# Altium schematic sheet UWB_mB_carrier.SchDoc: Top Level Design
size B; CompanyName: Rigado, LLC; Organization: Rigado; SheetNumber: 1; Website: www.rigado.com; SheetSize: B
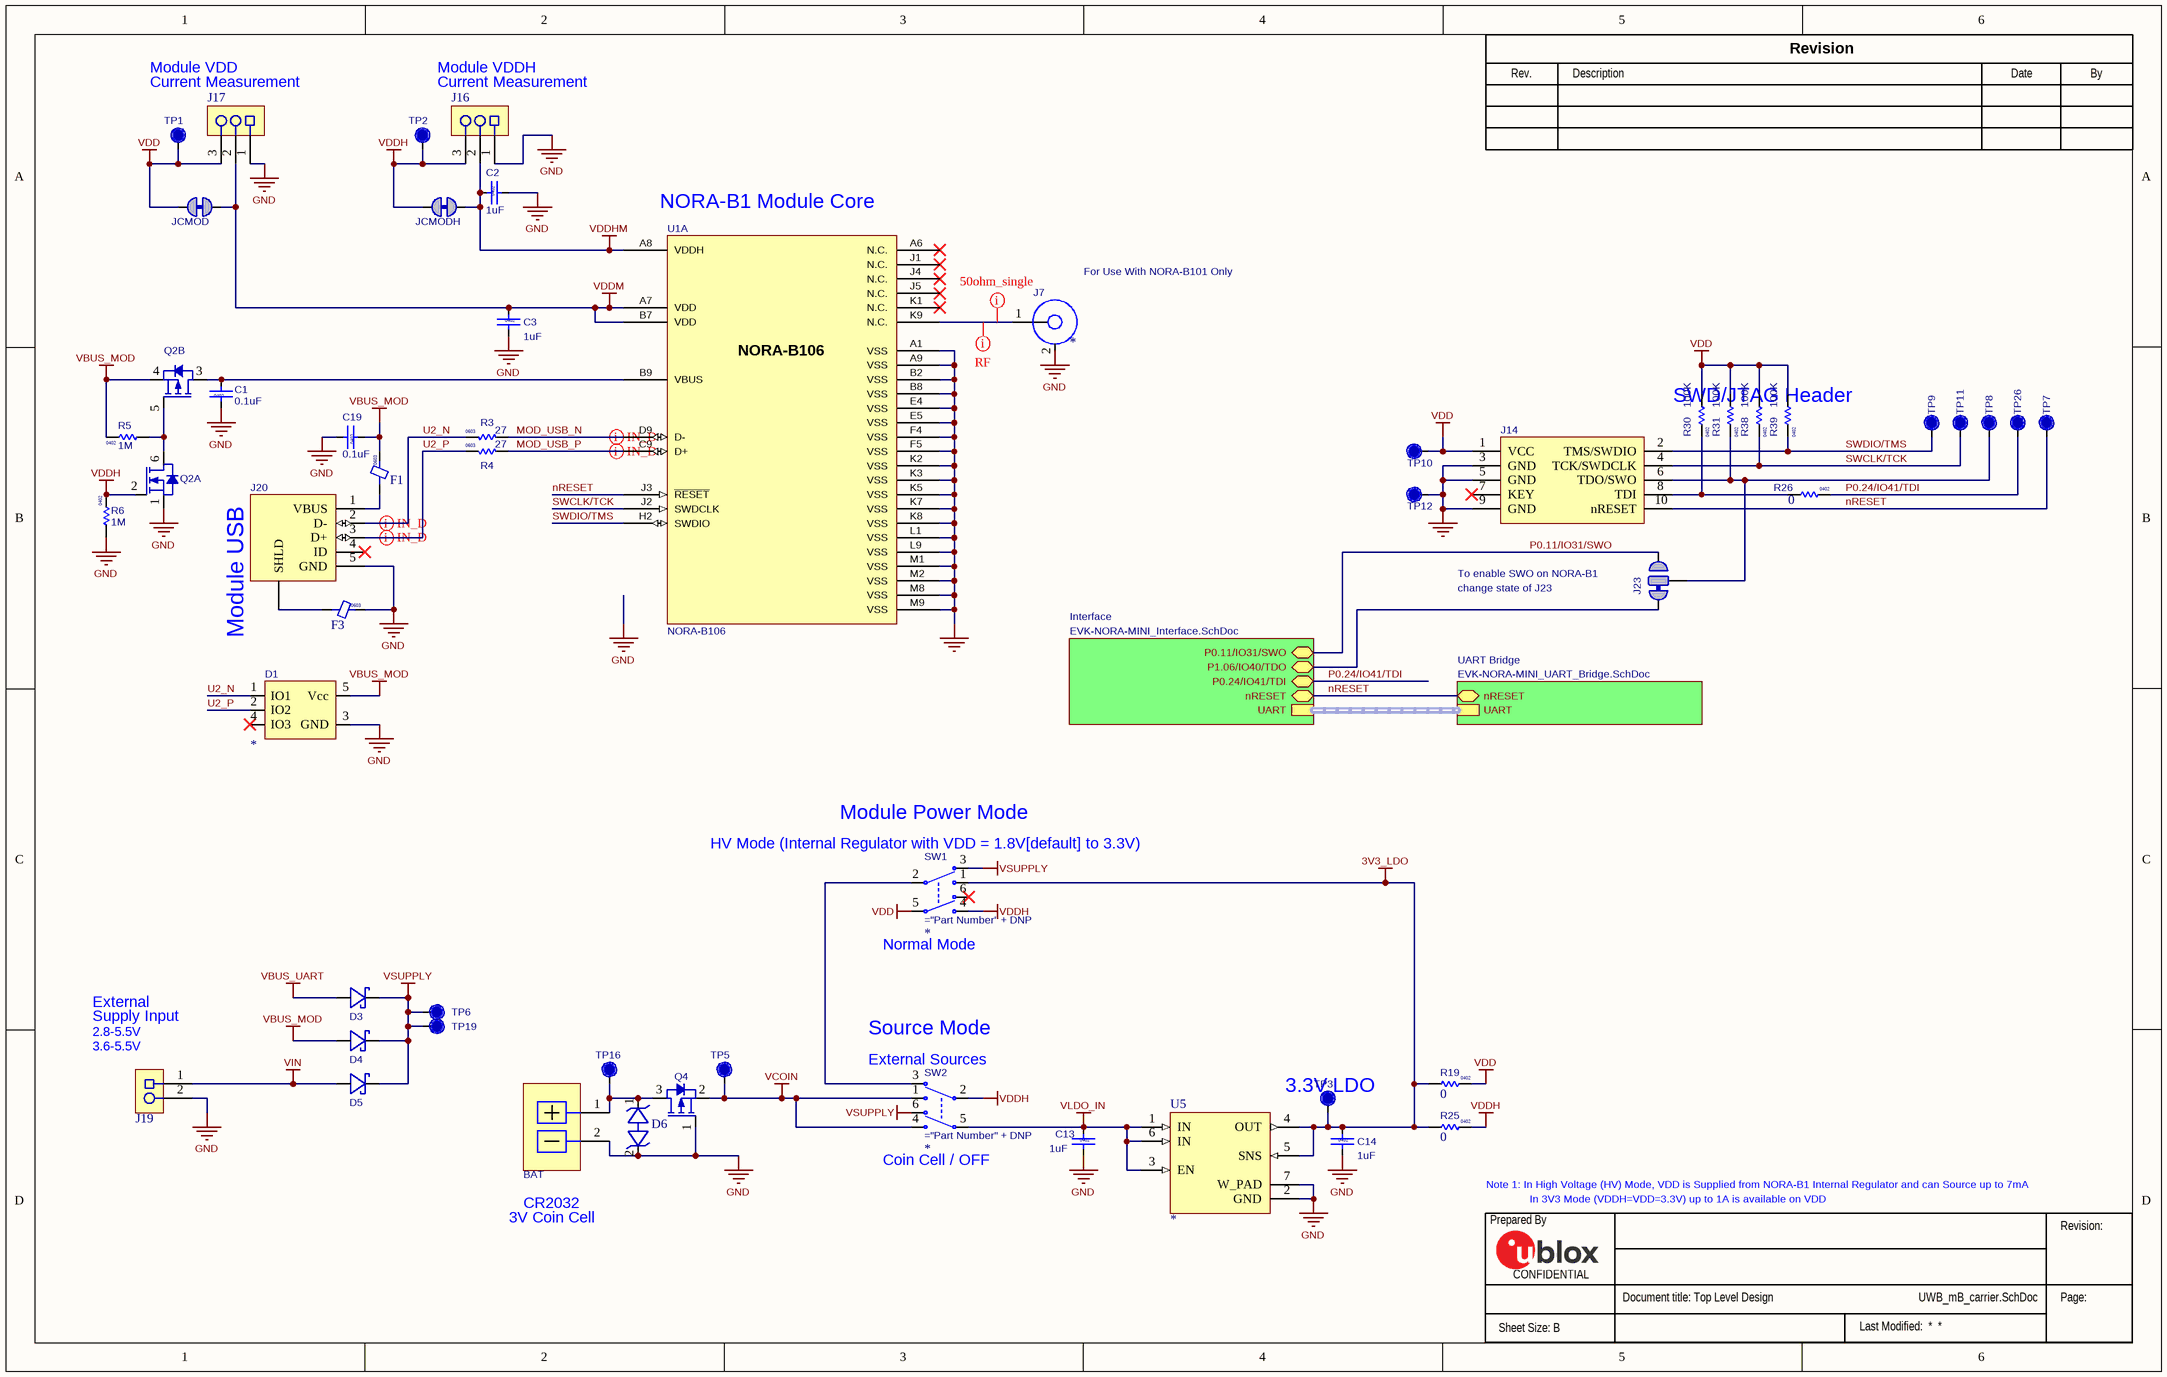
[diagram p0: UWB_mB_carrier.SchDoc]

## Parts
(Parts that share a designator on the sheet are numbered #1, #2 ... from top to bottom, then left to right.)
?#1  (no value)  (graphical)
?#2  (no value)  (graphical)
BAT  (no value)  [3034]
C1  value 0.1uF  Size: 0402  [Cap 0402 HD]
C2  value 1uF  Size: 0402  [Cap 0402 HD]
C3  value 1uF  Size: 0402  [Cap 0402 HD]
C13  value 1uF  Size: 0402  [Cap 0402 HD]
C14  value 1uF  Size: 0402  [Cap 0402 HD]
C19  value 0.1uF  Size: 0402  [Cap 0402 HD]
D1  (no value)  [SOT-553]
D3  (no value)  [Diode 0603 HD]
D4  (no value)  [Diode 0603 HD]
D5  (no value)  [Diode 0603 HD]
D6  (no value)  [SOD-323]
F1  Size: 0603  [IND 0603 HD]
F3  Size: 0603  [IND 0603 HD]
J7  (no value)  [U.FL_3Pin]
J14  (no value)  [HDR.050P-10Pin-2x5-SMT_Key]
J16  (no value)  [PREC003SAAN-RC]
J17  (no value)  [PREC003SAAN-RC]
J19  (no value)  [PREC002SAAN-RC]
J20  (no value)  [USB_Micro_RA_W-2TABS]
J23  Solderbridge-OptionDNP  [Solderbridge-Option]  (value not drawn)  (net tie, no BOM)
JCMOD  Solderbridge-ShortDNP  [Solderbridge-Short]  (value not drawn)  (net tie, no BOM)
JCMODH  Solderbridge-ShortDNP  [Solderbridge-Short]  (value not drawn)  (net tie, no BOM)
Q2  (no value)  [SOT-563]  (parts A,B of 2)
Q4  (no value)  [SOT-723]
R3  value 27  Size: 0603  [RES 0603 HD]
R4  value 27  Size: 0603  [RES 0603 HD]
R5  value 1M  Size: 0402  [RES 0402 HD]
R6  value 1M  Size: 0402  [RES 0402 HD]
R19  value 0  Size: 0402  [RES 0402]
R25  value 0  Size: 0402  [RES 0402]
R26  value 0  Size: 0402  [RES 0402]
R30  value 100K  Size: 0402  [RES 0402 HD]
R31  value 100K  Size: 0402  [RES 0402 HD]
R38  value 100K  Size: 0402  [RES 0402 HD]
R39  value 100K  Size: 0402  [RES 0402 HD]
SW1  (no value)  [SW_Slide_DPDT_JS202011SCQN]
SW2  (no value)  [SW_Slide_DPDT_JS202011SCQN]
TP1  TP  [TP12R]  (value not drawn)  (no BOM)
TP2  TP  [TP12R]  (value not drawn)  (no BOM)
TP3  TP  [TP12R]  (value not drawn)  (no BOM)
TP5  TP  [TP12R]  (value not drawn)  (no BOM)
TP6  TP  [TP12R]  (value not drawn)  (no BOM)
TP7  TP  [TP12R]  (value not drawn)  (no BOM)
TP8  TP  [TP12R]  (value not drawn)  (no BOM)
TP9  TP  [TP12R]  (value not drawn)  (no BOM)
TP10  TP  [TP12R]  (value not drawn)  (no BOM)
TP11  TP  [TP12R]  (value not drawn)  (no BOM)
TP12  TP  [TP12R]  (value not drawn)  (no BOM)
TP16  TP  [TP12R]  (value not drawn)  (no BOM)
TP19  TP  [TP12R]  (value not drawn)  (no BOM)
TP26  TP  [TP12R]  (value not drawn)  (no BOM)
U1  NORA-B106  [NORA_LGA82R_1430X1040X180_ANT]  (part A of 3)
U5  (no value)  [DFN0.95P-6Pin_W-Pad]

## Sub-sheets
Interface = EVK-NORA-MINI_Interface.SchDoc: UART (harness UART), nRESET (bidir), P0.11/IO31/SWO (bidir), P1.06/IO40/TDO (bidir), P0.24/IO41/TDI (bidir)
UART Bridge = EVK-NORA-MINI_UART_Bridge.SchDoc: UART (harness UART), nRESET (bidir)

## Nets
3V3_LDO: C14.1 R19.1 R25.1 SW1.1(N.O-1) TP3.1 U5.4(OUT) U5.5(SNS)
GND: BAT.2 C1.1 C2.2 C3.2 C13.2 C14.2 C19.2 D1.3(GND) D6.2 F3.2 J7.2 J14.3(GND) J14.5(GND) J14.9(GND) J16.1 J17.1 J19.2 J20.5(GND) Q2.1(S1) Q4.1(G) R6.1 TP12.1 U1.A1(VSS) U1.A9(VSS) U1.B2(VSS) U1.B8(VSS) U1.E4(VSS) U1.E5(VSS) U1.F4(VSS) U1.F5(VSS) U1.K2(VSS) U1.K3(VSS) U1.K5(VSS) U1.K7(VSS) U1.K8(VSS) U1.L1(VSS) U1.L9(VSS) U1.M1(VSS) U1.M2(VSS) U1.M8(VSS) U1.M9(VSS) U5.2(GND) U5.7(W_PAD)
VBUS_MOD: C19.1 D1.5(Vcc) D4.A(Anode) F1.2 Q2.4(S2) R5.2
VBUS_UART: D3.A(Anode)
VCOIN: Q4.2(S) SW2.1(N.O-1) SW2.4(N.O-2) TP5.1
VDD: J14.1(VCC) J17.3 JCMOD.2 R19.2 R30.1 R31.1 R38.1 R39.1 SW1.5(COM-2) TP1.1 TP10.1
VDDH: J16.3 JCMODH.2 Q2.2(G1) R6.2 R25.2 SW1.4(N.O-2) SW2.2(COM-1) TP2.1
VDDHM: C2.1 J16.2 JCMODH.1 U1.A8(VDDH)
VDDM: C3.1 J17.2 JCMOD.1 U1.A7(VDD) U1.B7(VDD)
VIN: D5.A(Anode) J19.1
VLDO_IN: C13.1 SW2.5(COM-2) U5.1(IN) U5.3(EN) U5.6(IN)
VSUPPLY: D3.C(Cathode) D4.C(Cathode) D5.C(Cathode) SW1.3(N.C-1) SW2.6(N.C-2) TP6.1 TP19.1
MOD_USB_N: R3.1 U1.D9(D-)
MOD_USB_P: R4.1 U1.C9(D+)
nRESET: J14.10(nRESET) TP7.1 U1.J3(~{RESET}) ; sheet Interface/nRESET, sheet UART Bridge/nRESET
P0.11/IO31/SWO: J23.3 ; sheet Interface/P0.11/IO31/SWO
P0.24/IO41/TDI: R26.2 TP26.1 ; sheet Interface/P0.24/IO41/TDI
SWCLK/TCK: J14.4(TCK/SWDCLK) R38.2 TP11.1 U1.J2(SWDCLK)
SWDIO/TMS: J14.2(TMS/SWDIO) R39.2 TP9.1 U1.H2(SWDIO)
U2_N: D1.1(IO1) J20.2(D-) R3.2
U2_P: D1.2(IO2) J20.3(D+) R4.2
NetBAT_1: BAT.1 D6.1 Q4.3(D) TP16.1
NetC1_2: C1.2 Q2.3(D2) U1.B9(VBUS)
NetF1_1: F1.1 J20.1(VBUS)
NetF3_1: F3.1 J20.6(SHLD)
NetJ7_1: J7.1(ANT) U1.K9(N.C.)
NetJ14_6: J14.6(TDO/SWO) J23.2 R31.2 TP8.1
NetJ14_8: J14.8(TDI) R26.1 R30.2
NetJ23_1: J23.1 ; sheet Interface/P1.06/IO40/TDO
NetQ2_5: Q2.5(G2) Q2.6(D1) R5.1
NetSW1_2: SW1.2(COM-1) SW2.3(N.C-1)

Not connected (* = marked no-connect by the designer): D1 4(IO3)*; J14 7(KEY)*; J20 4(ID)*; SW1 6(N.C-2)*; U1 A6(N.C.)* J1(N.C.)* J4(N.C.)* J5(N.C.)* K1(N.C.)*

## Buses and harness runs
harness sheet Interface/UART = sheet UART Bridge/UART

## Layout directives
differential pair: MOD_USB_N, MOD_USB_P, U2_N, U2_P
net class 50_ohm_se: NetJ7_1
net class RF: NetJ7_1

## Notes on the sheet
- Module VDD
- Current Measurement
- Module VDDH
- (near U1) NORA-B1 Module Core
- (near J7) For Use With NORA-B101 Only
- SWD/JTAG Header
- To enable SWO on NORA-B1
- change state of J23
- (near J20) Module USB
- (near SW1) Module Power Mode
- (near SW1) HV Mode (Internal Regulator with VDD = 1.8V[default] to 3.3V)
- (near SW1) Normal Mode
- Supply Input
- External
- (near J19) 2.8-5.5V
- (near SW2) Source Mode
- (near J19) 3.6-5.5V
- (near SW2) External Sources
- 3.3V LDO
- (near SW2) Coin Cell / OFF
- 3V Coin Cell
- CR2032
- Note 1: In High Voltage (HV) Mode, VDD is Supplied from NORA-B1 Internal Regulator and can Source up to 7mA
- In 3V3 Mode (VDDH=VDD=3.3V) up to 1A is available on VDD
- Rev.
- Description
- Revision
- Date
- By
- Prepared By
- Revision:
- CONFIDENTIAL
- Page:

## Library data of the parts
?#1 = Top_Revision_Block: Release Revision History Block
?#2 = Top_Title_Block: Top level schematic title block for top level sheet
BAT = 3034: CR2032 Coin Cell Retainer 4.06mm Tall Surface Mount; Manufacturer 1: Keystone Electronics; Part Name: CON Coin Cell 20mm 2Pin, 1Row SMT; Item Phase: Pre-Production; Use in new designs: Yes; Voltage: None; Diameter: None; Height: 4.06; Max Operating Temp: None; Min Operating Temp: None; Pins: 2; Revision: 1; UBX Code: None; Manufacturer 2: None; Manufacturer Part Number 1: 3034; Supplier 1: Digi-Key; Supplier Part Number 1: 36-3034-ND; Manufacturer Part Number 2: None; Supplier 2: None; Supplier Part Number 2: None; Manufacturer P/N: *
C1 C19 = 120-00016: Cap, Ceramic 0.1uF 10V 10% X5R 0402; Part Name: CAP CER 0.1UF 10V 10% X5R 0402; Manufacturer 1: Murata Electronics North America; Manufacturer Part Number 1: GRM155R61A104KA01J; Tolerance: +/- 10%; Use in new designs: Yes; Item Phase: In Production; UBX Code: None; Part Number: 120-00016; Revision: 0A; Manufacturer 2: Yageo; Height: 0.55mm; Pins: 2; Temperature Coefficient: X5R; Voltage: 10V; Max Operating Temp: 85; Min Operating Temp: -55; Supplier 1: Digi-Key; Supplier Part Number 1: 490-6297-1-ND; Manufacturer Part Number 2: CC0402KRX5R6BB104; Supplier 2: Digi-Key; Supplier Part Number 2: 311-1336-1-ND
C2 C3 C13 C14 = 120-00088: CAP CER 1UF 6.3V 5% X5R 0402; Manufacturer 1: Samsung Electro-Mechanics America, Inc; Manufacturer Part Number 1: CL05A105JQ5NNNC; Tolerance: +/- 5%; Use in new designs: Yes; Item Phase: Unreleased; UBX Code: None; Part Number: 120-00088; Part Name: CAP CER 1UF 6.3V 5% X5R 0402; Pins: 2; Temperature Coefficient: X5R; Voltage: 6.3V; Manufacturer 2: None; Height: None; Max Operating Temp: 85; Min Operating Temp: -55; Revision: None; Supplier 1: Digi-Key; Supplier Part Number 1: 1276-1444-1-ND; Manufacturer Part Number 2: None; Supplier 2: None; Supplier Part Number 2: None
D1 = 110-00018: TVS Diode, ESD High Speed 3-Channel Array, SOT-553; Part Name: Diode TVS 5V 3CH SOT-553; Manufacturer 1: Texas Instruments; Manufacturer Part Number 1: TPD3E001DRLR; Body Size: 1.60mm x 1.20mm; MFG Package: SOT-553, DRL (R-PDSO-N5); Use in new designs: Yes; Voltage: 5.5V; Current: None; Item Phase: In Production; Manufacturer P/N: *; Part Number: 110-00018; Revision: 0A; Height: 0.60mm; Pins: 5; Manufacturer 2: None; Max Operating Temp: 85; Min Operating Temp: -40; UBX Code: None; Supplier 1: Digi-Key; Supplier Part Number 1: 296-21885-1-ND; Manufacturer Part Number 2: None; Supplier 2: None; Supplier Part Number 2: None
D3-D5 = 110-00015: Diode, Schottky, 20V 500mA, 470mV Vf @ 500mA, 0603; Part Name: Diode Schottky 20V 500mA 0603; Manufacturer 1: Comchip Technology; Manufacturer Part Number 1: CDBU0520; Body Size: 1.8mm x 1.0mm; MFG Package: 0603/SOD-523F; Use in new designs: Yes; Item Phase: In Production; UBX Code: None; Part Number: 110-00015; Revision: 0A; Manufacturer 2: Comchip Technology; Current: 500mA; Height: 0.85mm; Pins: 2; Voltage: 20V; Max Operating Temp: 125; Min Operating Temp: None; Supplier 1: Digi-Key; Supplier Part Number 1: 641-1332-1-ND; Manufacturer Part Number 2: CDBU0530; Supplier 2: Digi-Key; Supplier Part Number 2: 641-1285-1-ND
D6 = 110-00004: TVS Diode, ESD, Bidirectional, 5V SOD-323; Manufacturer 1: Diodes Incorporated; Manufacturer Part Number 1: D5V0L1B2WS-7DITR-ND; Part Name: D5V0L1B2WS; Body Size: 1.8mm x 1.4mm; Current: None; Item Phase: In Production; Use in new designs: Yes; Part Number: 110-00004; Supplier 1: Digi-Key; Supplier Part Number 1: D5V0L1B2WS-7DICT-ND; Manufacturer 2: Diodes Incorporated; Manufacturer Part Number 2: D5V0L1B2WS-7DITR-ND; Supplier 2: Mouser; Supplier Part Number 2: 621-D5V0L1B2WS-7; Height: 1.1mm; MFG Package: SOD-323; Max Operating Temp: 150; Min Operating Temp: -65; Pins: 2; Revision: 0A; Voltage: 5V; UBX Code: None
F1 F3 = 155-00001: Ferrite Bead 600ohm 500mA 0603; Manufacturer 1: TDK Corporation; Manufacturer Part Number 1: MMZ1608Y601BTA00; Part Name: FB 0603 600 ohm 500mA; Body Size: None; Item Phase: In Production; Use in new designs: Yes; Part Number: 155-00001; Supplier 1: Digi-Key; Supplier Part Number 1: 445-1551-1-ND; Current: 500mA; Height: 0.95mm; MFG Package: None; Max Operating Temp: 125; Min Operating Temp: -55; Pins: 2; Revision: 0A; Value: 600 ohm; Voltage: None; Manufacturer 2: None; Manufacturer Part Number 2: None; Supplier 2: None; Supplier Part Number 2: None; UBX Code: None
J7 = 130-00067: U.FL jack, SMA 50 ohm, 3 pin, SMT; Part Name: CON RF UMC U.FL Jack 3Pin SMT; Manufacturer 1: Hirose Electric Co Ltd; Manufacturer Part Number 1: U.FL-R-SMT(10); Use in new designs: Yes; Item Phase: In Production; Voltage: None; UBX Code: UBXH04-0001026; Manufacturer P/N: *; Part Number: 130-00067; Revision: 0A; Manufacturer 2: Dongguan Qintai Electronics Co, Ltd.; Height: 1.25mm; Pins: 3; Diameter: None; Max Operating Temp: 90; Min Operating Temp: -40; Supplier 1: Digi-Key; Supplier Part Number 1: H9161CT-ND; Manufacturer Part Number 2: MHF-RT-1; Supplier 2: Rayson Technology co., ltd; Supplier Part Number 2: MHF-RT-1
J14 = 130-00099: Header 0.05" 10Pin 2Row SMD Black; Part Name: CON HDR 0.05" 10Pin 2Row SMD Black; Manufacturer 1: Samtec; Manufacturer Part Number 1: FTSH-105-01-F-DV-K; Use in new designs: Yes; Item Phase: In Production; Voltage: None; Part Number: 130-00099; Revision: 0A; Height: 6mm; Pins: 10; Diameter: None; Max Operating Temp: 125; Min Operating Temp: -55; UBX Code: None; Manufacturer 2: None; Supplier 1: Digi-Key; Supplier Part Number 1: SAM8796-ND; Manufacturer Part Number 2: None; Supplier 2: None; Supplier Part Number 2: None
J16 J17 = PREC003SAAN-RC: Header, 0.100" Pitch, 3 Pin, Vert TH, Black; Manufacturer 1: Sullins Connector Solutions; Part Name: CON HDR 0.1" 3 Pin 1 Row TH Vert; Item Phase: In Production; Use in new designs: Yes; Voltage: None; Part Number: PREC003SAAN-RC; Manufacturer Part Number 1: PREC003SAAN-RC; Supplier 1: None; Supplier Part Number 1: None; Diameter: None; Height: 8.34mm; Max Operating Temp: None; Min Operating Temp: None; Pins: 3; Revision: 0A; UBX Code: None; Manufacturer 2: None; Manufacturer Part Number 2: None; Supplier 2: None; Supplier Part Number 2: None
J19 = PREC002SAAN-RC: Header, 0.100" Pitch, 2 Pin, Vert TH, Black; Manufacturer 1: Sullins Connector Solutions; Part Name: CON HDR 0.1" 2 Pin 1 Row TH Vert; Item Phase: In Production; Use in new designs: Yes; Voltage: None; Part Number: PREC002SAAN-RC; Manufacturer Part Number 1: PREC002SAAN-RC; Supplier 1: None; Supplier Part Number 1: None; Diameter: None; Height: 8.34mm; Max Operating Temp: None; Min Operating Temp: None; Pins: 2; Revision: 0A; UBX Code: None; Manufacturer 2: None; Manufacturer Part Number 2: None; Supplier 2: None; Supplier Part Number 2: None
J20 = 130-00008: USB Micro B Receptacle, Right Angle SMT with 2 TH Tabs, 0.65mm; Part Name: CON USB Micro-B SMT RA 2 Tabs; Manufacturer 1: Seeed Technology; Manufacturer Part Number 1: Rigado 130-00008; Use in new designs: Yes; Item Phase: In Production; Voltage: None; Part Number: 130-00008; Manufacturer 2: FCI; Height: 3.10mm; Revision: 0B; Pins: 5; Diameter: None; Max Operating Temp: None; Min Operating Temp: None; UBX Code: None; Supplier 1: Seeed Technology; Supplier Part Number 1: Rigado 130-00008; Manufacturer Part Number 2: 10118193-0001LF; Supplier 2: Digi-Key; Supplier Part Number 2: 609-4616-1-ND
J23 = Solderbridge-Option: Added By: Paul B; Part Number: Solderbridge-Option; Height: 0; DNP: DNP; Added Date: 12/3/2015
JCMOD JCMODH = Solderbridge-Short: Added By: Paul B; Part Number: Solderbridge-Short; Height: 0; DNP: DNP; Added Date: 12/2/2015
Q2 = 140-00030: MOSFET N/P-CH 20V SOT-563, 540 mA, −430 mA; Manufacturer 1: ON Semiconductor; Manufacturer Part Number 1: NTZD3155CT2G; Body Size: 1.6mmx1.6mm; Transistor Type: Multiple; Use in new designs: Yes; Item Phase: In Production; Thermal Pad: No; UBX Code: None; Part Number: 140-00030; Part Name: MOSFET N/P-CH 20V SOT-563; Supplier 1: Digi-Key; Supplier Part Number 1: NTZD3155CT2GOSCT-ND; Current: 540 mA, −430 mA; Height: 0.6mm; MFG Package: SOT-563; Pins: 6; Voltage: 20V; Max Operating Temp: 150; Min Operating Temp: -55; Revision: 0A; Manufacturer 2: None; Manufacturer Part Number 2: None; Supplier 2: None; Supplier Part Number 2: None
Q4 = 140-00005: P-MOSFET, 20V, 100mA, SOT-723-3; Part Name: MOSFET P-CH 20V 0.1A VMT3; Manufacturer 1: Rohm Semiconductor; Manufacturer Part Number 1: RZM001P02T2L; Body Size: 1.2mm x 0.8mm; Transistor Type: P-Channel; Use in new designs: Yes; Item Phase: In Production; Thermal Pad: No; UBX Code: None; Part Number: 140-00005; Current: 100mA; Height: 0.5mm; MFG Package: SOT-723; Pins: 3; Voltage: 20V; Max Operating Temp: 150; Min Operating Temp: -55; Revision: 0B; Manufacturer 2: Toshiba Semiconductor and Storage; Supplier 1: Digi-Key; Supplier Part Number 1: RZM001P02T2LCT-ND; Manufacturer Part Number 2: SSM3J35MFV,L3F; Supplier 2: Digi-Key; Supplier Part Number 2: SSM3J35MFVL3FCT-ND
R3 R4 = 180-00006: Resistor 27 ohm 5%, 1/10W, 0603; Part Name: RES SMD 27 OHM 5% 1/10W 0603; Manufacturer 1: Samsung Electro-Mechanics America, Inc; Manufacturer Part Number 1: RC1608J270CS; Tolerance: +/- 5%; Use in new designs: Yes; Item Phase: In Production; UBX Code: None; Part Number: 180-00006; Manufacturer 2: Hong Kong Resistors Manufactory; Height: 0.55mm; Power: 1/10W; Revision: 0D; Pins: 2; Voltage: N/A; Max Operating Temp: 155; Min Operating Temp: -55; Supplier 1: Digi-Key; Supplier Part Number 1: 1276-5024-1-ND; Manufacturer Part Number 2: RCT0327RJLF; Supplier 2: Hong Kong Resistors Manufactory; Supplier Part Number 2: RCT0327RJLF
R5 R6 = 180-00054: Resistor 1M ohm 1%, 1/16W, 0402; Manufacturer 1: Samsung Electro-Mechanics America, Inc; Manufacturer Part Number 1: RC1005F105CS; Part Name: RES SMD 1M OHM 1% 1/16W 0402; Item Phase: In Production; Tolerance: +/- 1%; Use in new designs: Yes; Voltage: None; Part Number: 180-00054; Supplier 1: Digi-Key; Supplier Part Number 1: 1276-3433-1-ND; Manufacturer 2: Hong Kong Resistors Manufactory; Manufacturer Part Number 2: RCT021MFLF; Supplier 2: None; Supplier Part Number 2: None; Height: 0.4mm; Max Operating Temp: 155; Min Operating Temp: -55; Pins: 2; Power: 1/16W; Revision: 0D; UBX Code: None
R19 R25 R26 = 180-00185: RES 0 200PPM 5% 0.063W 0402 ROHS; Manufacturer 1: Hong Kong Resistors Manufactory; Manufacturer Part Number 1: RCT020RLF; Part Name: RES SMD 0.0OHM JUMPER 1/16W 0402; Item Phase: In Production; Power: 1/16W; Tolerance: Other; Use in new designs: Yes; Voltage: None; Part Number: 180-00185; Supplier 1: None; Supplier Part Number 1: None; Manufacturer 2: Uniohm; Manufacturer Part Number 2: 0402WGJ0000T1E; Supplier 2: None; Supplier Part Number 2: None; Height: 0.4mm; Max Operating Temp: 155; Min Operating Temp: -55; Pins: 2; Revision: 0A; UBX Code: None
R30 R31 R38 R39 = 180-00093: Resistor 100K ohm 1% 1/16W, 0402; Part Name: RES SMD 100K ohm 1% 1/16W 0402; Manufacturer 1: Yageo; Manufacturer Part Number 1: RC0402FR-07100KL; Tolerance: +/- 1%; Use in new designs: Yes; Voltage: None; Item Phase: In Production; Part Number: 180-00093; Revision: 0B; Manufacturer 2: Rohm Semiconductor; Height: 0.4mm; Pins: 2; Power: 1/16W; Max Operating Temp: 155; Min Operating Temp: -55; UBX Code: None; Supplier 1: Digi-Key; Supplier Part Number 1: 311-100KLRCT-ND; Manufacturer Part Number 2: MCR01MRTF1003; Supplier 2: Digi-Key; Supplier Part Number 2: RHM100KCDCT-ND
SW1 SW2 = 137-00006: Switch Slide DPDT, 300mA, 6V, SMT; Manufacturer 1: C&K Components; Part Name: Switch Slide DPDT 300mA 6V SMT; Manufacturer Part Number 1: JS202011SCQN; Item Phase: In Production; Use in new designs: Yes; UBX Code: None; Part Number: 137-00006; Manufacturer P/N: *; Current: 300mA; Height: 3.5mm; Max Operating Temp: 85; Min Operating Temp: -40; Pins: 6; Revision: 0B; Voltage: 6V; Manufacturer 2: Seeed Technology; Supplier 1: Digi-Key; Supplier Part Number 1: 401-2002-1-ND; Manufacturer Part Number 2: Rigado 137-00006; Supplier 2: Seeed Technology; Supplier Part Number 2: Rigado 137-00006
TP1-TP3 TP5-TP12 TP16 TP19 TP26 = TP_R: Testpoint, Round 1.0mm Dia; Part Number: TP10R; Added By: Jeremy D; Size: 1.0mm; Height: 0; DNP: DNP; Added Date: 2/1/2015; Checked By: Paul B; Checked Date: 2/5/2015
U1 = NORA-B106: u-blox NORA-B106 Bluetooth 5.2 LE module - dual core; Manufacturer P/N: NORA-B106-00B; Part Description: Stand-alone Bluetooth low energy module - dual core; Body Size: 14.3 mm x 10.4 mm; Part Number: NORA-B106; Part Name: NORA-B106; Part_Type: Module; Manufacturer: u-blox; Height: 1.8 mm; Value: NORA-B106
U5 = 260-00045: IC REG LDO 3.3V 1A 6DFN; Manufacturer 1: ON Semiconductor; Body Size: 3mm x 3mm; Item Phase: Unreleased; Reg Outputs: None; MFG Package: 6-VDFN Exposed Pad; SMT Pitch: 0.95mm; Thermal Pad: Yes; Manufacturer P/N: *; Part Number: 260-00045; Manufacturer Part Number 1: NCP692MN33T2G; Supplier 1: Digi-Key; Supplier Part Number 1: NCP692MN33T2GOSTR-ND; Current: 1A; Height: 1mm; Max Operating Temp: 85; Min Operating Temp: -40; Part Name: NCP692MN33T2G; Pins: 6; Revision: None; Use in new designs: Yes; Voltage: 3.3V; UBX Code: None; Manufacturer 2: None; Manufacturer Part Number 2: None; Supplier 2: None; Supplier Part Number 2: None